# Altium project DigiBuckBoostConverter.PrjPcb
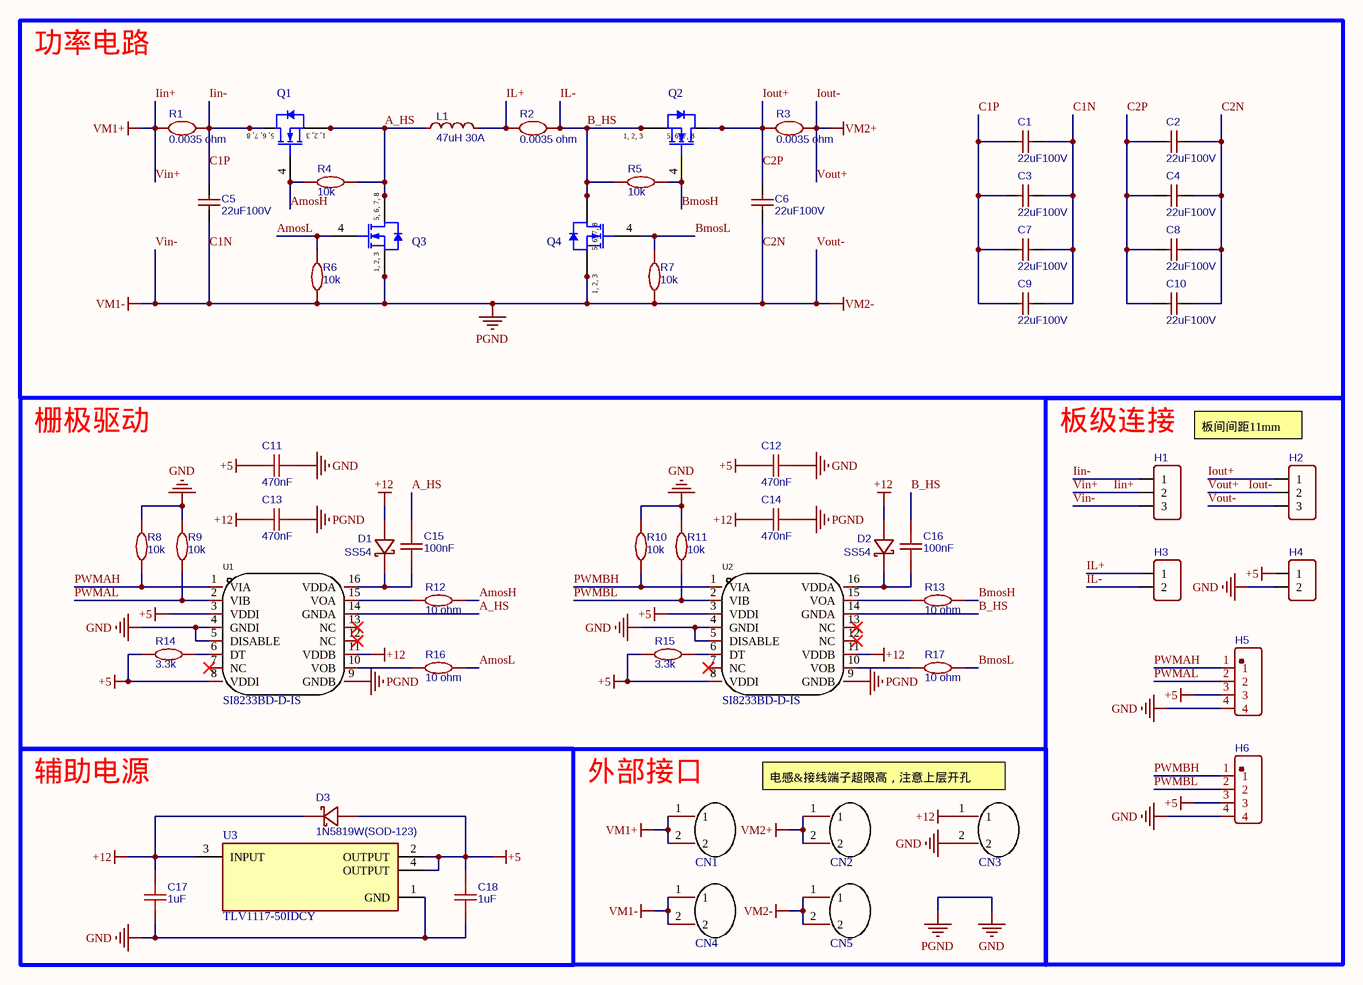
[diagram p0: mainPower.SchDoc]
2 sheets, 137 parts. Net scope: global (net labels, ports and power ports of the same name join across sheets).
Board files: mainPower.PcbDoc, STM32H7.PcbDoc
Sheets:
  mainPower.SchDoc
  STM32H7.SchDoc

## Sheet mainPower.SchDoc
size A3; SheetNumber: 1; SheetTotal: 2

### Parts
C1  22uF100V  [C1206]
C2  22uF100V  [C1206]
C3  22uF100V  [C1206]
C4  22uF100V  [C1206]
C5  22uF100V  [C1206]
C6  22uF100V  [C1206]
C7  22uF100V  [C1206]
C8  22uF100V  [C1206]
C9  22uF100V  [C1206]
C10  22uF100V  [C1206]
C11  470nF  [C0603]
C12  470nF  [C0603]
C13  470nF  [C0603]
C14  470nF  [C0603]
C15  100nF  [C0603]
C16  100nF  [C0603]
C17  1uF  [C0603]
C18  1uF  [C0603]
CN1  1729128  [CONN-TH_2P-P5.08]  (value not drawn)
CN2  1729128  [CONN-TH_2P-P5.08]  (value not drawn)
CN3  1729128  [CONN-TH_2P-P5.08]  (value not drawn)
CN4  1729128  [CONN-TH_2P-P5.08]  (value not drawn)
CN5  1729128  [CONN-TH_2P-P5.08]  (value not drawn)
D1  SS54  [SMA]
D2  SS54  [SMA]
D3  1N5819W(SOD-123)  [SOD-123]
H1  Header-Male-2.54_1x3  [HDR2.54-LI-3P]  (value not drawn)
H2  Header-Male-2.54_1x3  [HDR2.54-LI-3P]  (value not drawn)
H3  Header-Male-2.54_1x2  [HDR2.54-LI-2P]  (value not drawn)
H4  Header-Male-2.54_1x2  [HDR2.54-LI-2P]  (value not drawn)
H5  Header-Male-2.54_1x4  [HDR2.54-LI-4P]  (value not drawn)
H6  Header-Male-2.54_1x4  [HDR2.54-LI-4P]  (value not drawn)
L1  47uH 30A  [106-125立式]
Q1  BSC070N10NS3 G  [INF-PG-TDSON-8-1_V]  (value not drawn)
Q2  BSC070N10NS3 G  [INF-PG-TDSON-8-1_V]  (value not drawn)
Q3  BSC070N10NS3 G  [INF-PG-TDSON-8-1_V]  (value not drawn)
Q4  BSC070N10NS3 G  [INF-PG-TDSON-8-1_V]  (value not drawn)
R1  0.0035 ohm  [R2512]
R2  0.0035 ohm  [R2512]
R3  0.0035 ohm  [R2512]
R4  10k  [R0603]
R5  10k  [R0603]
R6  10k  [R0603]
R7  10k  [R0603]
R8  10k  [R0603]
R9  10k  [R0603]
R10  10k  [R0603]
R11  10k  [R0603]
R12  10 ohm  [R0603]
R13  10 ohm  [R0603]
R14  3.3k  [R0603]
R15  3.3k  [R0603]
R16  10 ohm  [R0603]
R17  10 ohm  [R0603]
U1  SI8233BD-D-IS  [SOIC-16_L10.3-W7.5-P1.27-LS10.3-BL]
U2  SI8233BD-D-IS  [SOIC-16_L10.3-W7.5-P1.27-LS10.3-BL]
U3  TLV1117-50IDCY  [FP-DCY0004A-MFG]

### Blocks framed on the sheet
功率电路: C1-C10 L1 Q1-Q4 R1-R7
栅极驱动: C11-C16 D1 D2 R8-R17 U1 U2
板级连接: H1-H6
辅助电源: C17 C18 D3 U3
外部接口: CN1-CN5

### Nets
+5: C11.2 C12.2 C18.2 D3.1(A) H4.1 H5.3 H6.3 R14.1 R15.1 U1.3(VDDI) U1.8(VDDI) U2.3(VDDI) U2.8(VDDI) U3.2(OUTPUT) U3.4(OUTPUT)
+12: C13.2 C14.2 C17.2 CN3.1 D1.1(A) D2.1(A) D3.2(K) U1.11(VDDB) U2.11(VDDB) U3.3(INPUT)
C1N: C1.2 C2.2 C3.2 C4.2 C5.1 C6.1 C7.2 C8.2 C9.2 C10.2 C11.1 C12.1 C13.1 C14.1 C17.1 C18.1 CN3.2 CN4.1 CN4.2 CN5.1 CN5.2 H1.3 H2.3 H4.2 H5.4 H6.4 Q3.1(SOURCE) Q3.2(SOURCE) Q3.3(SOURCE) Q4.1(SOURCE) Q4.2(SOURCE) Q4.3(SOURCE) R6.1 R7.1 R8.2 R9.2 R10.2 R11.2 U1.4(GNDI) U1.5(DISABLE) U1.9(GNDB) U2.4(GNDI) U2.5(DISABLE) U2.9(GNDB) U3.1(GND)  [also labelled C2N, GND, PGND, Vin-, VM1-, VM2-, Vout-]
Iin+: CN1.1 CN1.2 H1.2 R1.1  [also labelled Vin+, VM1+]
Iout-: CN2.1 CN2.2 H2.2 R3.2  [also labelled VM2+, Vout+]
A_HS: C15.2 L1.1 Q1.1(SOURCE) Q1.2(SOURCE) Q1.3(SOURCE) Q3.5(DRAIN) Q3.6(DRAIN) Q3.7(DRAIN) Q3.8(DRAIN) R4.1 U1.14(GNDA)
AmosH: Q1.4(GATE) R4.2 R12.2
AmosL: Q3.4(GATE) R6.2 R16.2
B_HS: C16.2 H3.2 Q2.1(SOURCE) Q2.2(SOURCE) Q2.3(SOURCE) Q4.5(DRAIN) Q4.6(DRAIN) Q4.7(DRAIN) Q4.8(DRAIN) R2.2 R5.2 U2.14(GNDA)  [also labelled IL-]
BmosH: Q2.4(GATE) R5.1 R13.2
BmosL: Q4.4(GATE) R7.2 R17.2
C1P: C1.1 C3.1 C5.2 C7.1 C9.1 H1.1 Q1.5(DRAIN) Q1.6(DRAIN) Q1.7(DRAIN) Q1.8(DRAIN) R1.2  [also labelled Iin-]
C2P: C2.1 C4.1 C6.2 C8.1 C10.1 H2.1 Q2.5(DRAIN) Q2.6(DRAIN) Q2.7(DRAIN) Q2.8(DRAIN) R3.1  [also labelled Iout+]
IL+: H3.1 L1.2 R2.1
PWMAH: H5.1 R8.1 U1.1(VIA)
PWMAL: H5.2 R9.1 U1.2(VIB)
PWMBH: H6.1 R10.1 U2.1(VIA)
PWMBL: H6.2 R11.1 U2.2(VIB)
NetC15_1: C15.1 D1.2(K) U1.16(VDDA)
NetC16_1: C16.1 D2.2(K) U2.16(VDDA)
NetR12_1: R12.1 U1.15(VOA)
NetR13_1: R13.1 U2.15(VOA)
NetR14_2: R14.2 U1.6(DT)
NetR15_2: R15.2 U2.6(DT)
NetR16_1: R16.1 U1.10(VOB)
NetR17_1: R17.1 U2.10(VOB)

Not connected (* = marked no-connect by the designer): U1 7(NC)* 12(NC)* 13(NC)*; U2 7(NC)* 12(NC)* 13(NC)*

### Notes on the sheet
- 板间间距11mm
- 电感&接线端子超限高，注意上层开孔
- (in symbol BSC070N10NS3G) 5, 6, 7, 8; 1, 2, 3

### Library data of the parts
C1-C10 = C1206: BOM_Manufacturer: FH; BOM_Manufacturer Part: 1206B102K202NT; nameAlias: Capacitance; BOM_Supplier: LCSC; BOM_Supplier Part: C9196; BOM_JLCPCB Part Class: Basic Part; spicePre: C; spiceSymbolName: 1206B102K202NT
C11-C18 = C0603: BOM_Manufacturer: YAGEO; BOM_Manufacturer Part: CC0603KRX7R9BB104; nameAlias: Capacitance; BOM_Supplier: LCSC; BOM_Supplier Part: C14663; BOM_JLCPCB Part Class: Basic Part; spicePre: C; spiceSymbolName: CC0603KRX7R9BB104
CN1-CN5 = MKDSN5.08-2P: 间距:5.08mm;排数:1;每排PIN数:2;安装方式:直针;额定电流:13.5A;额定电压:400V;工作温度范围:-;颜色:绿色;; Manufacturer: Phoenix Contact(菲尼克斯); Symbol: MKDSN1.5/2-5.08; Add into BOM: yes; Pitch: 5.08mm; Number of PINs Per Row: 2; Current Rating (Max): 13.5A; Voltage Rating (Max): 400V; Device: 1729128; LCSC Part Name: 5.08mm 排数:1 每排P数:2 直针; Supplier Part: C91153; Manufacturer Part: 1729128; Supplier Footprint: 插件,P=5.08mm; JLCPCB Part Class: Extended Part; Datasheet: https://atta.szlcsc.com/upload/public/pdf/source/20161226/1482720163948.pdf; Supplier: LCSC; Convert to PCB: yes; Number of Rows: 1; Mounting Style: 直针; Operating Temperature Range: -; Color: 绿色
D1 D2 = SS34(SMA): BOM_Manufacturer: Doeshare(德芯); BOM_Manufacturer Part: SS34; Contributor: LCSC; BOM_Supplier: LCSC; BOM_Supplier Part: C2931787; BOM_JLCPCB Part Class: Extended Part; spicePre: D; spiceSymbolName: SS34_C2931787
D3 = 1N5819W(SOD-123): BOM_Manufacturer: Doeshare(德芯); BOM_Manufacturer Part: SS34; Contributor: LCSC; BOM_Supplier: LCSC; BOM_Supplier Part: C2931787; BOM_JLCPCB Part Class: Extended Part; spicePre: D; spiceSymbolName: SS34_C2931787
H1 H2 = Header-Male-2.54_1x3: BOM_Manufacturer: BOOMELE; BOM_Manufacturer Part: Header2.54mm 1*3P; BOM_Supplier: LCSC; BOM_Supplier Part: C49257; BOM_JLCPCB Part Class: Extended Part; spicePre: H; spiceSymbolName: Header-Male-2.54_1x3
H3 H4 = Header-Male-2.54_1x2: BOM_Manufacturer: BOOMELE; BOM_Manufacturer Part: Header2.54mm 1*3P; BOM_Supplier: LCSC; BOM_Supplier Part: C49257; BOM_JLCPCB Part Class: Extended Part; spicePre: H; spiceSymbolName: Header-Male-2.54_1x3
H5 H6 = Header-Male-2.54_1x4: BOM_Manufacturer: Boom Precision Elec; BOM_Manufacturer Part: C247921; Contributor: LCSC; BOM_Supplier: LCSC; BOM_Supplier Part: C247921; BOM_JLCPCB Part Class: Extended Part; spicePre: H; spiceSymbolName: C247921
L1 = 106-125铁硅铝磁环电感: BOM_Manufacturer: FH(风华); BOM_Manufacturer Part: HA42-4R7MT; nameAlias: Inductance; Contributor: LCSC; BOM_Supplier: LCSC; BOM_Supplier Part: C2936653; BOM_JLCPCB Part Class: Extended Part; spicePre: L; spiceSymbolName: HA42-4R7MT
Q1-Q4 = BSC070N10NS3G: N-Channel OptiMOS 3 Power-Transistor, 100 V VDS, 90 A ID, -55 to 150 degC, PG-TDSON-8-1, Reel, Green; Manufacturer: Infineon; QG: 42Â nC; VGS(th) (min): 2Â V; RDS (on) (max): 7Â mOhm; ID (max): 90Â A; Polarity: N; RthJC (max): 1.1Â K/W; RthJA (max): 50Â K/W; VDS (max): 100Â V; Ptot (max): 114Â W; VGS(th) (max): 3.5Â V; IDpuls (max): 360Â A; Green: TRUE; ComponentLink2Description: Datasheet; DatasheetVersion: Rev. 2.0; Mounting Technology: Surface Mount; ComponentLink1Description: Manufacturer URL; ComponentLink3Description: Package Specification; ComponentLink1URL: http://www.infineon.com/; PackageDescription: 8-Pin Plastic (Green) Thin Dual Small Outline Non-Leaded Package, 5.15 x 5.9 mm Body, 1.27 mm Pitch; Packing: Reel; ComponentLink3URL: http://www.infineon.com/cms/packages/SMD_-_Surface_Mounted_Devices/P-PG-TDSON/P-PG-TDSON-08-01x_2x_3.html?__locale=en; PackageReference: PG-TDSON-8-1; PartNumber: BSC070N10NS3 G; Halogen-free: TRUE; Rth: 1.1Â K/W; ComponentLink2URL: http://www.infineon.com/dgdl/BSC070N10NS3+Rev2+1.pdf?folderId=db3a304313b8b5a60113cee8763b02d7&fileId=db3a304327b89750012824712c6c6f2f; Manufacturer Part Number: BSC070N10NS3G
R1-R3 = R2512: BOM_Manufacturer: YAGEO; BOM_Manufacturer Part: SR2512FK-0751RL; nameAlias: Resistance (Ohms); Contributor: LCSC; Resistance: 51Ω; BOM_Supplier: LCSC; BOM_Supplier Part: C375694; BOM_JLCPCB Part Class: Extended Part; spicePre: R; spiceSymbolName: SR2512FK-0751RL
R4-R17 = R0603: BOM_Manufacturer: YAGEO; BOM_Manufacturer Part: SR0603JR-071RL; nameAlias: Resistance (Ohms); Contributor: LCSC; Resistance: 1Ω; BOM_Supplier: LCSC; BOM_Supplier Part: C326890; BOM_JLCPCB Part Class: Extended Part; spicePre: R; spiceSymbolName: SR0603JR-071RL
U1 U2 = SI8233BD-D-IS: 高速隔离半桥栅极驱动器; Manufacturer: SILICON LABS(芯科); Add into BOM: yes; Name: SI8233BD-D-IS; Symbol: SI8233BD-D-IS; Device: SI8233BD-D-IS; LCSC Part Name: SI8233BD-D-IS; Supplier Part: C430246; Manufacturer Part: SI8233BD-D-IS; Supplier Footprint: SOIC-16_W; JLCPCB Part Class: Extended Part; Datasheet: https://atta.szlcsc.com/upload/public/pdf/source/20190920/C430246_81ACDC97509C517087989819A83AC3BD.pdf; Supplier: LCSC; Convert to PCB: yes
U3 = CMP-04917-000165-1: IC REG LINEAR 5V 800MA SOT223-4; Dropout Voltage: 1.2V; Input Bias Current: 5mA; Output Type: Fixed; Quiescent Current: 15mA; Number of Regulators: 1; Min Input Voltage: 6.4V; Polarity: Positive; Max Input Voltage: 15V; Reference Voltage: 5.2V; Case/Package: SOT-223; Series: -; Radiation Hardening: No; Width: 3.7mm; Lead Free: Lead Free; Min Operating Temperature: -40°C; Mount: Surface Mount; Packaging: Rail/Tube; Min Current Limit: 800mA; Max Output Current: 800mA; Height: 1.7mm; Output Current: 800mA; Number of Outputs: 1; REACH SVHC: No SVHC; Nominal Output Voltage: 5V; Length: 6.7mm; Max Operating Temperature: 125°C; Output Voltage: 5V; Number of Pins: 3; Package Quantity: 80; RoHS Compliant: Yes

## Sheet STM32H7.SchDoc
size A3; SheetNumber: 2; SheetTotal: 2
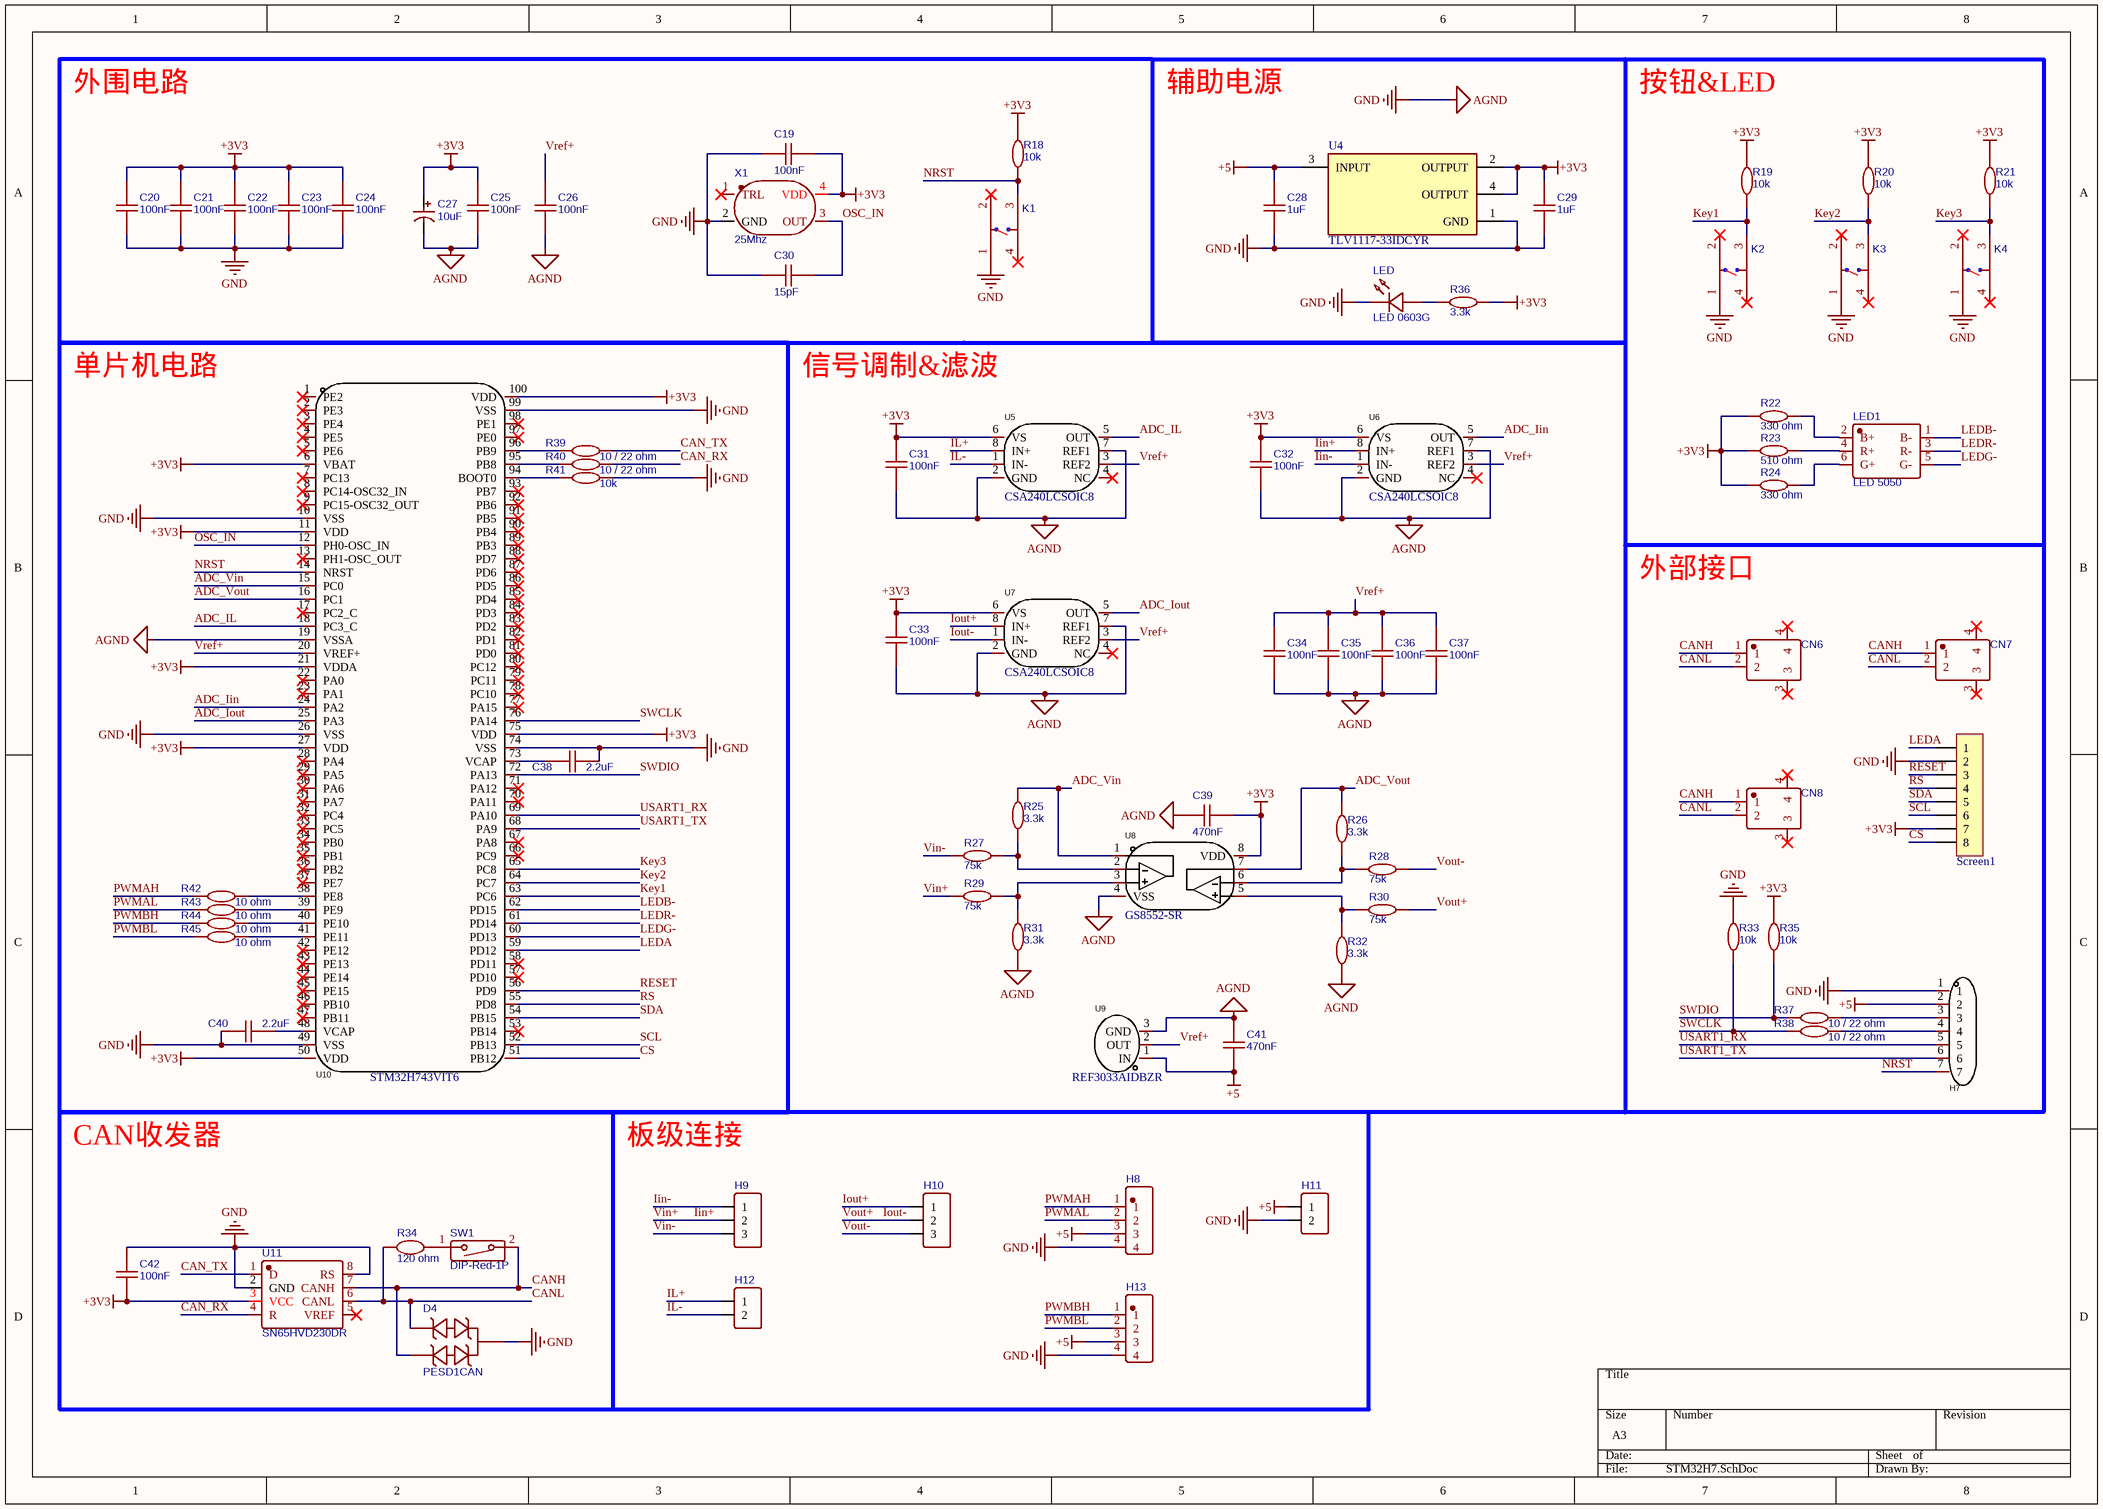
[diagram p1: STM32H7.SchDoc]

### Parts
C19  100nF  [C0603]
C20  100nF  [C0603]
C21  100nF  [C0603]
C22  100nF  [C0603]
C23  100nF  [C0603]
C24  100nF  [C0603]
C25  100nF  [C0603]
C26  100nF  [C0603]
C27  10uF  [CD A(3216)]
C28  1uF  [C0603]
C29  1uF  [C0603]
C30  15pF  [C0603]
C31  100nF  [C0603]
C32  100nF  [C0603]
C33  100nF  [C0603]
C34  100nF  [C0603]
C35  100nF  [C0603]
C36  100nF  [C0603]
C37  100nF  [C0603]
C38  2.2uF  [C0603]
C39  470nF  [C0603]
C40  2.2uF  [C0603]
C41  470nF  [C0603]
C42  100nF  [C0603]
CN6  A1257WR-S-2P  [CONN-SMD_A1257WR-S-2P]  (value not drawn)
CN7  A1257WR-S-2P  [CONN-SMD_A1257WR-S-2P]  (value not drawn)
CN8  A1257WR-S-2P  [CONN-SMD_A1257WR-S-2P]  (value not drawn)
D4  PESD1CAN  [SOT-23-3_L2.9-W1.6-P1.90-LS2.8-BR]
H7  7P卧贴排母  [HDR-SMD_7P-P2.54-H-F-L11.5]  (value not drawn)
H8  Header-Female-2.54_1x4  [HDR2.54-M-LI-4P]  (value not drawn)
H9  Header-Female-2.54_1x3  [HDR2.54-M-LI-3P]  (value not drawn)
H10  Header-Female-2.54_1x3  [HDR2.54-M-LI-3P]  (value not drawn)
H11  Header-Female-2.54_1x2  [HDR2.54-M-LI-2P]  (value not drawn)
H12  Header-Female-2.54_1x2  [HDR2.54-M-LI-2P]  (value not drawn)
H13  Header-Female-2.54_1x4  [HDR2.54-M-LI-4P]  (value not drawn)
K1  TSW SMD-6*6*5  [TSW SMD-6*6*5]  (value not drawn)
K2  TSW SMD-6*6*5  [TSW SMD-6*6*5]  (value not drawn)
K3  TSW SMD-6*6*5  [TSW SMD-6*6*5]  (value not drawn)
K4  TSW SMD-6*6*5  [TSW SMD-6*6*5]  (value not drawn)
LED  LED 0603G  [LED 0603G]
LED1  LED 5050  [LED 5050]
R18  10k  [R0603]
R19  10k  [R0603]
R20  10k  [R0603]
R21  10k  [R0603]
R22  330 ohm  [R0603]
R23  510 ohm  [R0603]
R24  330 ohm  [R0603]
R25  3.3k  [R0603]
R26  3.3k  [R0603]
R27  75k  [R0603]
R28  75k  [R0603]
R29  75k  [R0603]
R30  75k  [R0603]
R31  3.3k  [R0603]
R32  3.3k  [R0603]
R33  10k  [R0603]
R34  120 ohm  [R0805]
R35  10k  [R0603]
R36  3.3k  [R0603]
R37  10 / 22 ohm  [R0603]
R38  10 / 22 ohm  [R0603]
R39  10 / 22 ohm  [R0603]
R40  10 / 22 ohm  [R0603]
R41  10k  [R0603]
R42  10 ohm  [R0603]
R43  10 ohm  [R0603]
R44  10 ohm  [R0603]
R45  10 ohm  [R0603]
Screen1  FPC1.0-8P  [FPC0.5 2H-S-W-8P]  (value not drawn)
SW1  DIP-Red-1P  [CSW DIP-1P_G]
U4  TLV1117-33IDCYR  [FP-DCY0004A-MFG]
U5  CSA240LCSOIC8  [SOIC-8_L4.9-W3.9-P1.27-LS6.0-BL]
U6  CSA240LCSOIC8  [SOIC-8_L4.9-W3.9-P1.27-LS6.0-BL]
U7  CSA240LCSOIC8  [SOIC-8_L4.9-W3.9-P1.27-LS6.0-BL]
U8  GS8552-SR  [SOIC-8_L4.9-W3.9-P1.27-LS6.0-BL]
U9  REF3033AIDBZR  [SOT-23-3_L3.0-W1.7-P0.95-LS2.9-BR]
U10  STM32H743VIT6  [LQFP-100_L14.0-W14.0-P0.50-LS16.0-BL]
U11  SN65HVD230DR  [SOP-8]
X1  25Mhz  [OSC 3225-4P]

### Blocks framed on the sheet
外围电路: C19-C27 C30 K1 R18 X1
辅助电源: C28 C29 LED R36 U4
单片机电路: C38 C40 R39-R45 U10
信号调制&滤波: C31-C37 C39 C41 R25-R32 U5-U9

### Nets
+3V3: C19.2 C20.2 C21.2 C22.2 C23.2 C24.2 C25.1 C27.1 C29.2 C31.2 C32.2 C33.2 C39.2 C42.1 R18.2 R19.2 R20.2 R21.2 R22.2 R23.2 R24.2 R35.2 R36.1 Screen1.7 U4.2(OUTPUT) U4.4(OUTPUT) U5.6(VS) U6.6(VS) U7.6(VS) U8.8(VDD) U10.6(VBAT) U10.11(VDD) U10.21(VDDA) U10.27(VDD) U10.50(VDD) U10.75(VDD) U10.100(VDD) U11.3(VCC) X1.4(VDD)
+5: C28.2 C41.1 H7.2 H8.3 H11.1 H13.3 U4.3(INPUT) U9.1(IN)
AGND: C19.1 C20.1 C21.1 C22.1 C23.1 C24.1 C25.2 C26.1 C27.2 C28.1 C29.1 C30.2 C31.1 C32.1 C33.1 C34.2 C35.1 C36.1 C37.2 C38.1 C39.1 C40.2 C41.2 C42.2 D4.3 H7.1 H8.4 H9.3 H10.3 H11.2 H13.4 K1.1 K2.1 K3.1 K4.1 LED.2(K) R27.1 R28.2 R31.1 R32.1 R33.2 R41.1 Screen1.2 U4.1(GND) U5.2(GND) U5.7(REF1) U6.2(GND) U6.7(REF1) U7.2(GND) U7.7(REF1) U8.4(VSS) U9.3(GND) U10.10(VSS) U10.19(VSSA) U10.26(VSS) U10.49(VSS) U10.74(VSS) U10.99(VSS) U11.2(GND) U11.8(RS) X1.2(GND)  [also labelled GND, Vin-, Vout-]  [project net C1N]
Iin+: H9.2 R29.1 U6.8(IN+)  [also labelled Vin+]
Iout-: H10.2 R30.2 U7.1(IN-)  [also labelled Vout+]
ADC_Iin: U6.5(OUT) U10.24(PA2)
ADC_IL: U5.5(OUT) U10.18(PC3_C)
ADC_Iout: U7.5(OUT) U10.25(PA3)
ADC_Vin: R25.2 U8.1(OUTA) U10.15(PC0)
ADC_Vout: R26.2 U8.7(OUTB) U10.16(PC1)
CAN_RX: R40.1 U11.4(R)
CAN_TX: R39.1 U11.1(D)
CANH: CN6.1 CN7.1 CN8.1 D4.2 SW1.2 U11.7(CANH)
CANL: CN6.2 CN7.2 CN8.2 D4.1 R34.1 U11.6(CANL)
CS: Screen1.8 U10.51(PB12)
Iin-: H9.1 U6.1(IN-)  [project net C1P]
IL+: H12.1 U5.8(IN+)
IL-: H12.2 U5.1(IN-)  [project net B_HS]
Iout+: H10.1 U7.8(IN+)  [project net C2P]
Key1: K2.3 R19.1 U10.63(PC6)
Key2: K3.3 R20.1 U10.64(PC7)
Key3: K4.3 R21.1 U10.65(PC8)
LEDA: Screen1.1 U10.59(PD12)
LEDB-: LED1.1(B-) U10.62(PD15)
LEDG-: LED1.5(G-) U10.60(PD13)
LEDR-: LED1.3(R-) U10.61(PD14)
NRST: H7.7 K1.3 R18.1 U10.14(NRST)
OSC_IN: C30.1 U10.12(PH0-OSC_IN) X1.3(OUT)
PWMAH: H8.1 R42.2
PWMAL: H8.2 R43.2
PWMBH: H13.1 R44.2
PWMBL: H13.2 R45.2
RESET: Screen1.3 U10.56(PD9)
RS: Screen1.4 U10.55(PD8)
SCL: Screen1.6 U10.52(PB13)
SDA: Screen1.5 U10.54(PB15)
SWCLK: R33.1 R38.2 U10.76(PA14)
SWDIO: R35.1 R37.2 U10.72(PA13)
USART1_RX: H7.5 U10.69(PA10)
USART1_TX: H7.6 U10.68(PA9)
Vref+: C26.2 C34.1 C35.2 C36.2 C37.1 U5.3(REF2) U6.3(REF2) U7.3(REF2) U9.2(OUT) U10.20(VREF+)
NetC38_2: C38.2 U10.73(VCAP)
NetC40_1: C40.1 U10.48(VCAP)
NetH7_3: H7.3 R37.1
NetH7_4: H7.4 R38.1
NetLED1_2: LED1.2(B+) R22.1
NetLED1_4: LED1.4(R+) R23.1
NetLED1_6: LED1.6(G+) R24.1
NetLED_1: LED.1(A) R36.2
NetR25_1: R25.1 R27.2 U8.2(INA-)
NetR26_1: R26.1 R28.1 U8.6(INB-)
NetR29_2: R29.2 R31.2 U8.3(INA+)
NetR30_1: R30.1 R32.2 U8.5(INB+)
NetR34_2: R34.2 SW1.1
NetR39_2: R39.2 U10.96(PB9)
NetR40_2: R40.2 U10.95(PB8)
NetR41_2: R41.2 U10.94(BOOT0)
NetR42_1: R42.1 U10.38(PE8)
NetR43_1: R43.1 U10.39(PE9)
NetR44_1: R44.1 U10.40(PE10)
NetR45_1: R45.1 U10.41(PE11)

Not connected (* = marked no-connect by the designer): CN6 3* 4*; CN7 3* 4*; CN8 3* 4*; K1 2* 4*; K2 2* 4*; K3 2* 4*; K4 2* 4*; U5 4(NC)*; U6 4(NC)*; U7 4(NC)*; U10 1(PE2)* 2(PE3)* 3(PE4)* 4(PE5)* 5(PE6)* 7(PC13)* 8(PC14-OSC32_IN)* 9(PC15-OSC32_OUT)* 13(PH1-OSC_OUT)* 17(PC2_C)* 22(PA0)* 23(PA1)* 28(PA4)* 29(PA5)* 30(PA6)* 31(PA7)* 32(PC4)* 33(PC5)* 34(PB0)* 35(PB1)* 36(PB2)* 37(PE7)* 42(PE12)* 43(PE13)* 44(PE14)* 45(PE15)* 46(PB10)* 47(PB11)* 53(PB14)* 57(PD10)* 58(PD11)* 66(PC9)* 67(PA8)* 70(PA11)* 71(PA12)* 77(PA15)* 78(PC10)* 79(PC11)* 80(PC12)* 81(PD0)* 82(PD1)* 83(PD2)* 84(PD3)* 85(PD4)* 86(PD5)* 87(PD6)* 88(PD7)* 89(PB3)* 90(PB4)* 91(PB5)* 92(PB6)* 93(PB7)* 97(PE0)* 98(PE1)*; U11 5(VREF)*; X1 1(TRL)*

### Notes on the sheet
- 按钮&LED
- 外部接口
- CAN收发器
- 板级连接

### Library data of the parts
C19-C26 C28-C42 = C0603: as C11 on sheet mainPower; BOM_Supplier: LCSC; BOM_Supplier Part: C14663; BOM_JLCPCB Part Class: Basic Part; spicePre: C; spiceSymbolName: CC0603KRX7R9BB104
C27 = A型钽电容: 长3.2mm，宽1.6mm，厚1.6mm; BOM_Manufacturer: ValuePro; BOM_Manufacturer Part: 50V 100uF 8X12; nameAlias: Capacitance; BOM_Supplier: LCSC; BOM_Supplier Part: C2749; BOM_JLCPCB Part Class: Extended Part; spicePre: C; spiceSymbolName: 50V 100uF 8X12
CN6-CN8 = A1257WR-S-2P: BOM_Manufacturer: Changjiang Connectors; BOM_Manufacturer Part: A1257WV-S-2P; Contributor: LCSC; BOM_Supplier: LCSC; BOM_Supplier Part: C225118; BOM_JLCPCB Part Class: Extended Part; spicePre: C; spiceSymbolName: A1257WV-S-2P
D4 = PESD1CAN: BOM_Manufacturer: TECH PUBLIC; Contributor: LCSC; BOM_Supplier: LCSC; BOM_Supplier Part: C907838; BOM_Manufacturer Part: PESD1CAN; spicePre: D; spiceSymbolName: PESD1CAN_C907838
H7 = 7P卧贴排母: Manufacturer: XKB Connectivity(中国星坤); Name: X6511FRS-07-C85D30; Add into BOM: yes; Holes Structure: 1x7P; Pitch: 2.54mm; Number of Holes: 7P; Symbol: X6511FRS-07-C85D30; Device: X6511FRS-07-C85D30; LCSC Part Name: 间距:2.54mm 1x7P 卧贴; Supplier Part: C5142240; Manufacturer Part: X6511FRS-07-C85D30; Supplier Footprint: SMD,P=2.54mm; JLCPCB Part Class: Extended Part; Datasheet: https://atta.szlcsc.com/upload/public/pdf/source/20220822/AB9A82E80C220285963E5EFA3BFD32FF.pdf; Supplier: LCSC; Convert to PCB: yes; Mounting Type: 卧贴; Number of Rows: 单排; Insulation Height: 8.5mm
H8 H13 = Header-Female-2.54_1x4: BOM_Manufacturer: Boom Precision Elec; BOM_Manufacturer Part: C247921; Contributor: LCSC; BOM_Supplier: LCSC; BOM_Supplier Part: C247921; BOM_JLCPCB Part Class: Extended Part; spicePre: H; spiceSymbolName: C247921
H9 H10 = Header-Female-2.54_1x3: BOM_Manufacturer: BOOMELE; BOM_Manufacturer Part: Header2.54mm 1*3P; BOM_Supplier: LCSC; BOM_Supplier Part: C49257; BOM_JLCPCB Part Class: Extended Part; spicePre: H; spiceSymbolName: Header-Male-2.54_1x3
H11 H12 = Header-Female-2.54_1x2: BOM_Manufacturer: BOOMELE; BOM_Manufacturer Part: Header2.54mm 1*3P; BOM_Supplier: LCSC; BOM_Supplier Part: C49257; BOM_JLCPCB Part Class: Extended Part; spicePre: H; spiceSymbolName: Header-Male-2.54_1x3
K1-K4 = TSW SMD-6*6*5: BOM_Manufacturer: GANGYUAN(港源); BOM_Manufacturer Part: KAN0661-1001B; Contributor: LCSC; BOM_Supplier: LCSC; BOM_Supplier Part: C231715; BOM_JLCPCB Part Class: Extended Part; spicePre: S; spiceSymbolName: KAN0661-1001B
LED = LED 0603G: 绿色0603LED; BOM_Manufacturer: EVERLIGHT(台湾亿光); BOM_Manufacturer Part: 11-21/BHC-AQ2S2/2T; Contributor: lcsc; BOM_Supplier: LCSC; BOM_Supplier Part: C3014404; spicePre: L; spiceSymbolName: 11-21/BHC-AQ2S2/2T
LED1 = LED 5050: 5050RGB-LED; BOM_Manufacturer: EVERLIGHT(台湾亿光); BOM_Manufacturer Part: 11-21/BHC-AQ2S2/2T; Contributor: lcsc; BOM_Supplier: LCSC; BOM_Supplier Part: C3014404; spicePre: L; spiceSymbolName: 11-21/BHC-AQ2S2/2T
R18-R33 R35-R45 = R0603: as R4 on sheet mainPower; BOM_Supplier: LCSC; BOM_Supplier Part: C326890; BOM_JLCPCB Part Class: Extended Part; spicePre: R; spiceSymbolName: SR0603JR-071RL
R34 = R0805: BOM_Manufacturer: YAGEO; BOM_Manufacturer Part: SR0805FR-0710RL; Contributor: LCSC; Resistance: 10Ω; BOM_Supplier: LCSC; BOM_Supplier Part: C723409; BOM_JLCPCB Part Class: Extended Part; spicePre: R; spiceSymbolName: SR0805FR-0710RL
Screen1 = FPC-8P-0.5: FPC连接器; 版权归属: 黎明电子style; BOM名称: FPC连接器; 学习资源: https://lmdzstyle.taobao.com/
SW1 = DIP-Red-1P: BOM_Manufacturer: East Wei Elec; BOM_Manufacturer Part: VDG-10HG-R; Contributor: LCSC; BOM_Supplier: LCSC; BOM_Supplier Part: C45226; BOM_JLCPCB Part Class: Extended Part; spicePre: S; spiceSymbolName: VDG-10HG-R
U4 = CMP-04917-000056-1: IC REG LIN 3.3V 800MA SOT223-4; Manufacturer: Texas Instruments; Nominal Supply Current: 5mA; Dropout Voltage: 1.2V; Max Supply Voltage: 15V; Min Supply Voltage: 4.7V; Output Type: Fixed; Number Of Outputs: 1; Output Current: 0.8A; Standoff Height: 0.02mm; Max Junction Temp: +125°C; Lead Free: Yes; RoHS: TRUE; Temperature: -40°C to +125°C; Device Class L1: Integrated Circuits (ICs); Output Voltage: 3.3V; Device Class L3: Voltage Regulators - Linear; Octopart: https://octopart.com/tlv1117-33idcyr-texas+instruments-669250; Device Class L2: Power Management ICs; Package: DCY0004A; Temperature Range High: +125°C; Category: IC; Height: 1.8mm; Automotive: No; Digikey Description: IC REG LIN 3.3V 800MA SOT223-4; Temperature Range Low: -40°C; ComponentLink2URL: http://www.ti.com/lit/ds/symlink/tlv1117.pdf; ComponentLink2Description: Datasheet; Manufacturer Part Number: TLV1117-33IDCYR; Mouser Description: LDO Voltage Regulators Fixed LDO Volt Reg
U5-U7 = CSA240LCSOIC8: 低噪声低温漂双向电流高端检测芯片; Manufacturer: analogysemi(类比半导体); Add into BOM: yes; Number of Channels: 1; Common Mode Voltage: 6V~80V; Gain: 20V/V; Supply Voltage: 2.7V~5.5V; Name: CSA240LCSOIC8; Symbol: CSA240LCSOIC8; Device: CSA240LCSOIC8; LCSC Part Name: 线性产品; Supplier Part: C5359411; Manufacturer Part: CSA240LCSOIC8; Supplier Footprint: SOIC-8; JLCPCB Part Class: Extended Part; Datasheet: https://atta.szlcsc.com/upload/public/pdf/source/20230221/4ACBE0500A397B3D4468D76F97F173B7.pdf; Supplier: LCSC; Convert to PCB: yes; Operating Temperature: -40℃~125℃
U8 = GS8552-SR: 1.5MHZ, 轨到轨高精双通道运放; Manufacturer: Gainsil(聚洵); Add into BOM: yes; Number of Circuits: 双路; Supply Voltage: 1.8V~5.5V; Gain Bandwidth Product(GBP): 1.8MHz; Slew Rate(SR): 0.95V/us; Supply Current: 180uA; Name: GS8552-SR; Symbol: GS8552-SR; Device: GS8552-SR; LCSC Part Name: GS8552-SR; Supplier Part: C157716; Manufacturer Part: GS8552-SR; Supplier Footprint: SOIC-8; JLCPCB Part Class: Extended Part; Datasheet: https://atta.szlcsc.com/upload/public/pdf/source/20200615/C605420_EE0E567F8FF01D919583B114644E1CC3.pdf; Supplier: LCSC; Convert to PCB: yes; Operating Temperature: -40℃~+125℃
U9 = REF3033AIDBZR: 3.3V基准电压源; Manufacturer: TI(德州仪器); Add into BOM: yes; Reference Type: 串联; Output Type: 固定; Input Voltage: 3.35V~5.5V; Output Voltage: 3.3V; Output Current: 25mA; Tolerance: ±0.2%; Temperature Coefficient: 75ppm/℃; Supply Current: 50uA; Noise - 10Hz to 10kHz: 105uVrms; Name: REF3033AIDBZR; Symbol: REF3033AIDBZR; Device: REF3033AIDBZR; LCSC Part Name: REF3033AIDBZR; Supplier Part: C36658; Manufacturer Part: REF3033AIDBZR; Supplier Footprint: SOT-23; JLCPCB Part Class: Extended Part; Datasheet: https://www.ti.com/cn/lit/gpn/ref3020; Supplier: LCSC; Convert to PCB: yes; Operating Temperature: -40℃~+125℃@(Ta)
U10 = STM32H743VIT6: STM32H7; Manufacturer: ST(意法半导体); Symbol: STM32H743VIT6_C114409; Add into BOM: yes; CPU Maximum Speed: 480MHz; Operating Voltage Range: 1.71V~3.6V; Program Storage Size: 2MB; GPIO Ports Number: 82; ADC (Bit): 16bit; DAC (Bit): 12bit; Universal Serial Bus: 有; Name: STM32H743VIT6; Device: STM32H743VIT6_C114409; LCSC Part Name: 480MHz; Supplier Part: C114409; Manufacturer Part: STM32H743VIT6; Supplier Footprint: LQFP-100(14x14); JLCPCB Part Class: Extended Part; Datasheet: https://atta.szlcsc.com/upload/public/pdf/source/20200508/C529058_DA70143F266D6D825C3A912656F12A87.pdf; Supplier: LCSC; Convert to PCB: yes; Watchdog: 有; Infrared Data Association: 有; Low-Voltage Detect: 有; LCD Module: 有; Secure Digital Input and Output: 有; Direct Memory Access: 有; Internal Oscillator: 有; Operating Temperature Range: -40℃~+85℃
U11 = SN65HVD230DR: 常用CAN收发器; BOM_Manufacturer: TI; BOM_Supplier: LCSC; BOM_Manufacturer Part: SN65HVD230DR; BOM_Supplier Part: C12084; BOM_JLCPCB Part Class: Basic Part; spicePre: U; spiceSymbolName: SN65HVD230DR
X1 = OSC-3225: BOM_Manufacturer: TAE(雅晶鑫); BOM_Manufacturer Part: TFOM8M4RHKCNT2T; Contributor: LCSC; BOM_Supplier: LCSC; BOM_Supplier Part: C454610; BOM_JLCPCB Part Class: Extended Part; spicePre: X; spiceSymbolName: TFOM8M4RHKCNT2T

## Nets that join several sheets
+5: mainPower (15 pins), STM32H7 (8 pins)
C1N: mainPower (45 pins), STM32H7 (61 pins)
Iin+: mainPower (CN1.1 CN1.2 H1.2 R1.1), STM32H7 (H9.2 R29.1 U6.8)
Iout-: mainPower (CN2.1 CN2.2 H2.2 R3.2), STM32H7 (H10.2 R30.2 U7.1)
B_HS: mainPower (12 pins), STM32H7 (H12.2 U5.1)
C1P: mainPower (11 pins), STM32H7 (H9.1 U6.1)
C2P: mainPower (11 pins), STM32H7 (H10.1 U7.8)
IL+: mainPower (H3.1 L1.2 R2.1), STM32H7 (H12.1 U5.8)
PWMAH: mainPower (H5.1 R8.1 U1.1), STM32H7 (H8.1 R42.2)
PWMAL: mainPower (H5.2 R9.1 U1.2), STM32H7 (H8.2 R43.2)
PWMBH: mainPower (H6.1 R10.1 U2.1), STM32H7 (H13.1 R44.2)
PWMBL: mainPower (H6.2 R11.1 U2.2), STM32H7 (H13.2 R45.2)